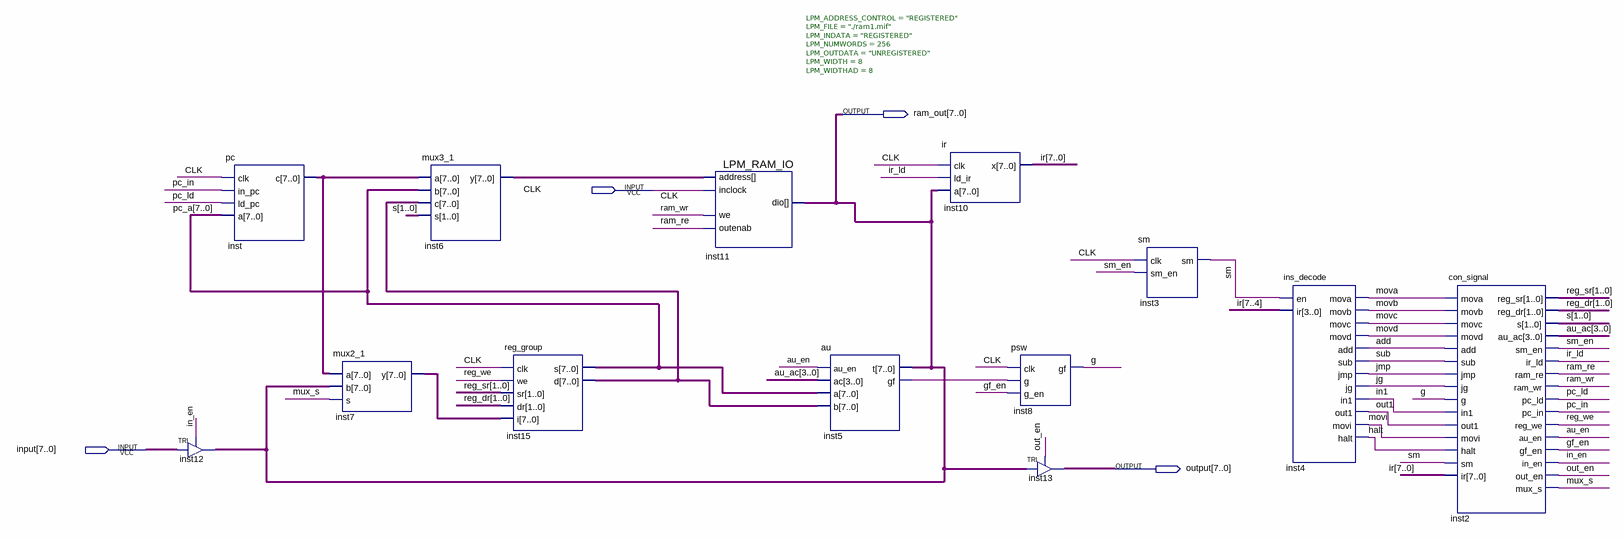
[diagram p0: schematic sheet]
// Quartus schematic Gcpu.bdf as structural Verilog: 13 symbols, 4 pins
module Gcpu (
  input  CLK,
  input  [7:0] \input ,
  output [7:0] ram_out,
  output [7:0] \output 
);

  wire add, au_en, g, gf_en, halt, in1, in_en, inst5_gf, ir_ld, jg, jmp, mova, movb, movc, movd, movi, mux_s,
       out1, out_en, pc_in, pc_ld, ram_re, ram_wr, reg_we, sm, sm_en, sub;
  wire [1:0] reg_dr, reg_sr, s;
  wire [3:0] au_ac;
  wire [7:0] inst6_y, inst7_y, inst15_d, inst_c, ir, pc_a;

  pc inst (.clk(CLK), .in_pc(pc_in), .ld_pc(pc_ld), .a(pc_a), .c(inst_c));
  TRI inst12[7:0] (.IN(\input ), .OE(in_en), .OUT(ram_out));
  mux2_1 inst7 (.a(inst_c), .b(ram_out), .s(mux_s), .y(inst7_y));
  mux3_1 inst6 (.a(inst_c), .b(pc_a), .c(inst15_d), .s(s), .y(inst6_y));
  reg_group inst15 (.clk(CLK), .we(reg_we), .sr(reg_sr), .dr(reg_dr), .i(inst7_y), .s(pc_a), .d(inst15_d));
  LPM_RAM_IO #(.LPM_ADDRESS_CONTROL("REGISTERED"), .LPM_FILE("./ram1.mif"), .LPM_INDATA("REGISTERED"), .LPM_NUMWORDS(256), .LPM_OUTDATA("UNREGISTERED"), .LPM_WIDTH(8), .LPM_WIDTHAD(8)) inst11 (
    .address(inst6_y), .inclock(CLK), .we(ram_wr), .outenab(ram_re), .dio(ram_out));
  au inst5 (.au_en(au_en), .ac(au_ac), .a(pc_a), .b(inst15_d), .t(ram_out), .gf(inst5_gf));
  ir inst10 (.clk(CLK), .ld_ir(ir_ld), .a(ram_out), .x(ir));
  psw inst8 (.clk(CLK), .g(inst5_gf), .g_en(gf_en), .gf(g));
  TRI inst13[7:0] (.IN(ram_out), .OE(out_en), .OUT(\output ));
  sm inst3 (.clk(CLK), .sm_en(sm_en), .sm(sm));
  ins_decode inst4 (
    .en(sm), .ir(ir[7:4]), .mova(mova), .movb(movb), .movc(movc), .movd(movd), .add(add), .sub(sub),
    .jmp(jmp), .jg(jg), .in1(in1), .out1(out1), .movi(movi), .halt(halt));
  con_signal inst2 (
    .mova(mova), .movb(movb), .movc(movc), .movd(movd), .add(add), .sub(sub), .jmp(jmp), .jg(jg), .g(g),
    .in1(in1), .out1(out1), .movi(movi), .halt(halt), .sm(sm), .ir(ir), .reg_sr(reg_sr), .reg_dr(reg_dr),
    .s(s), .au_ac(au_ac), .sm_en(sm_en), .ir_ld(ir_ld), .ram_re(ram_re), .ram_wr(ram_wr), .pc_ld(pc_ld),
    .pc_in(pc_in), .reg_we(reg_we), .au_en(au_en), .gf_en(gf_en), .in_en(in_en), .out_en(out_en),
    .mux_s(mux_s));
endmodule
